# EasyEDA Pro project ProPrj_Open Quantum Front Cover_2025-07-02.epro

# Schematic Schematic1
Board Name: Board1; Create Date: 2025-06-29; Page Name: P1; Project Name: Open Quantum Front Cover; Schematic Name: Schematic1; Update Date: 2025-06-29; Company: EasyEDA.com; Page Size: A4; Version: V1.0
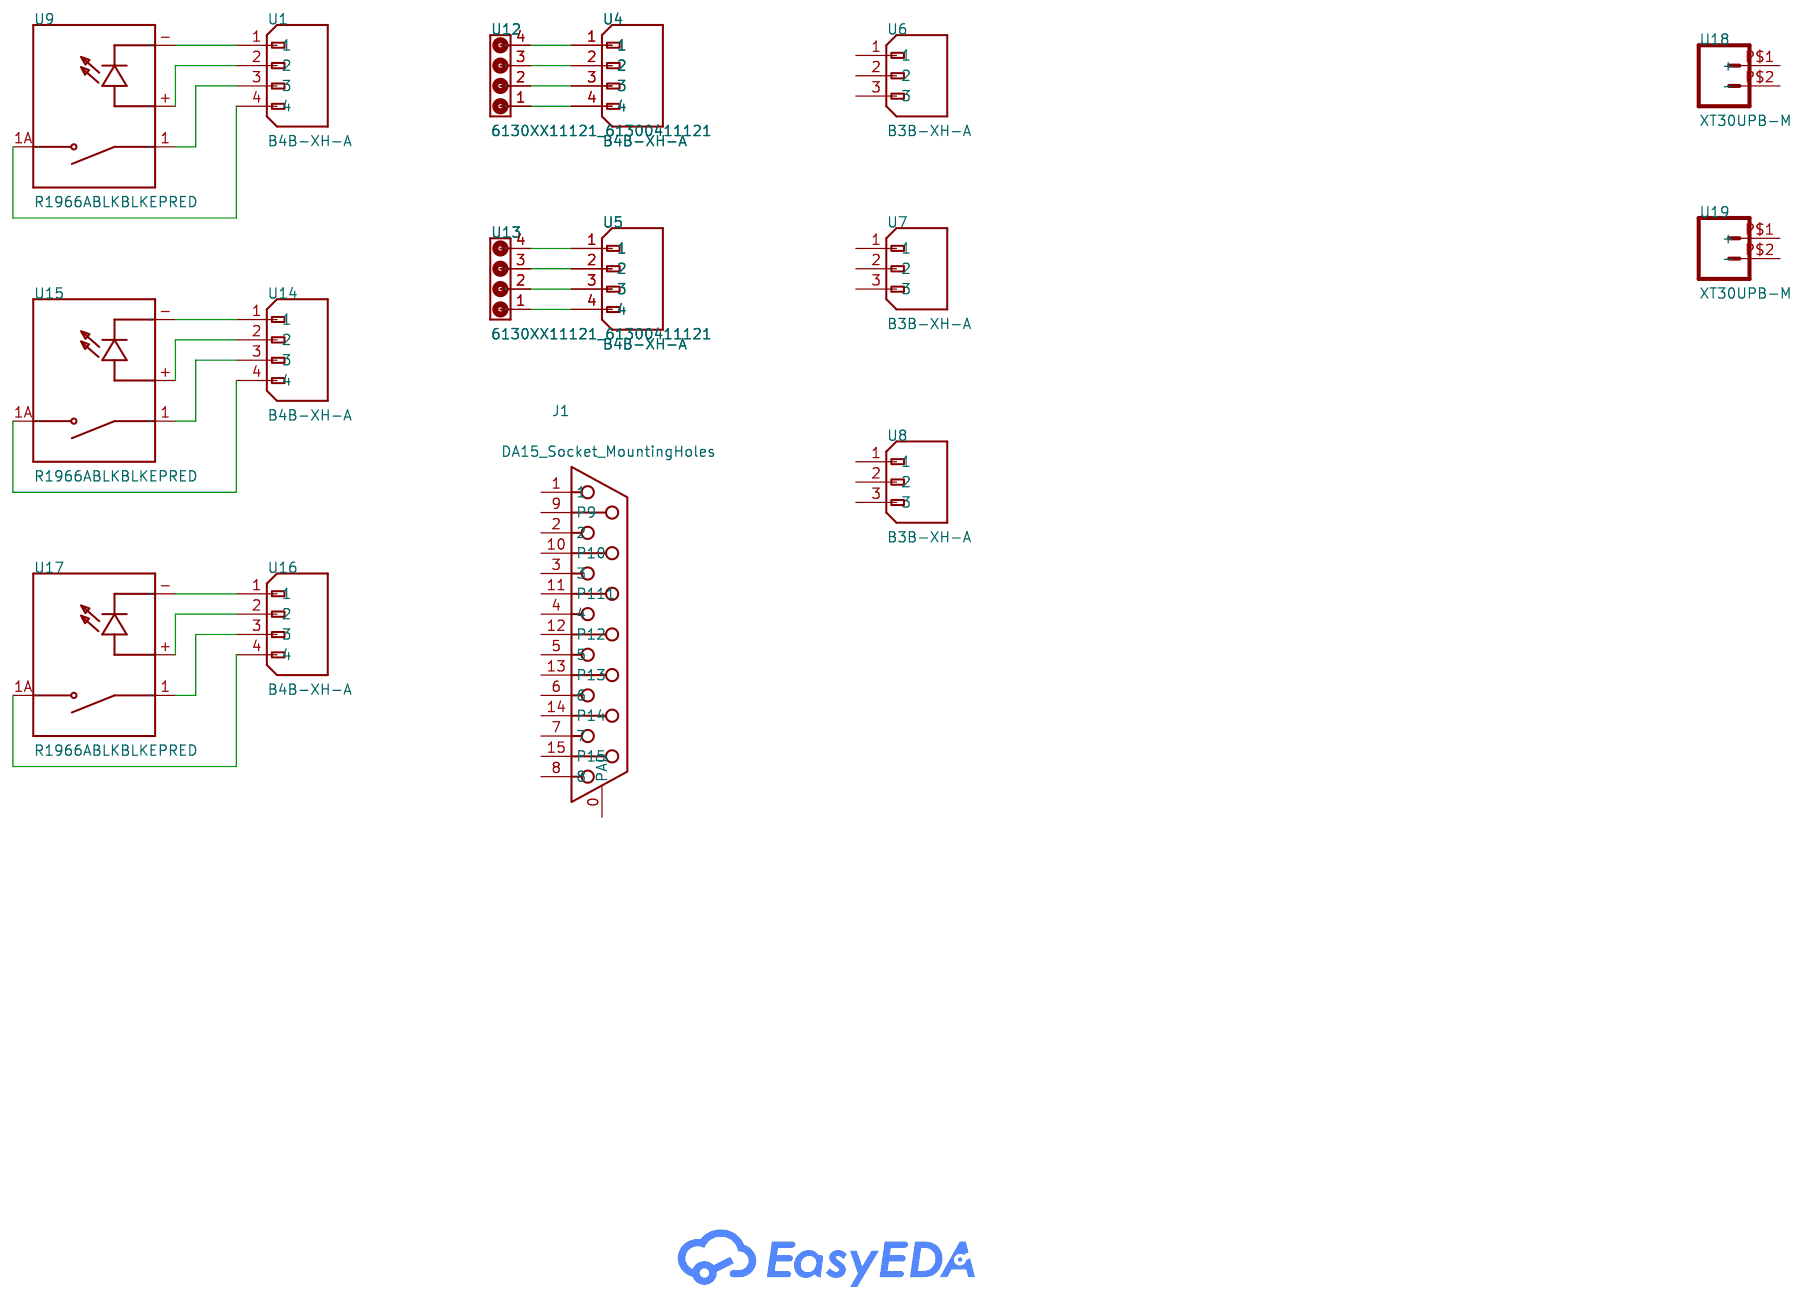
[diagram p0: schematic sheet]

## Parts
J1  DA15_Socket_MountingHoles  [Connector_Dsub:DSUB-15_Socket_Vertical_P2.77x2.84mm_MountingHoles]
U1  B4B-XH-A  [JST_B4B-XH-A]
U4  B4B-XH-A  [JST_B4B-XH-A]
U5  B4B-XH-A  [JST_B4B-XH-A]
U6  B3B-XH-A  [JST_B3B-XH-A]
U7  B3B-XH-A  [JST_B3B-XH-A]
U8  B3B-XH-A  [JST_B3B-XH-A]
U9  R1966ABLKBLKEPRED  [SW_R1966ABLKBLKEPRED]
U12  6130XX11121_61300411121  [61300411121]
U13  6130XX11121_61300411121  [61300411121]
U14  B4B-XH-A  [JST_B4B-XH-A]
U15  R1966ABLKBLKEPRED  [SW_R1966ABLKBLKEPRED]
U16  B4B-XH-A  [JST_B4B-XH-A]
U17  R1966ABLKBLKEPRED  [SW_R1966ABLKBLKEPRED]
U18  XT30UPB-M  [XT30UPB-M]
U19  XT30UPB-M  [XT30UPB-M]

## Library data of the parts
J1 = Connector_DA15_Socket_MountingHoles: 15-pin D-SUB connector, socket (female) (low-density/2 columns), Mounting Hole; Users: REF**
U1 U4 U5 U14 U16 = B4B-XH-A
U6-U8 = B3B-XH-A
U9 U15 U17 = R1966ABLKBLKEPRED
U12 U13 = 6130XX11121_61300411121
U18 U19 = XT30UPB-M

## Nets
$1N449: U4.1 U12.4
$1N451: U4.2 U12.3
$1N453: U4.3 U12.2
$1N455: U4.4 U12.1
$1N482: U5.1 U13.4
$1N484: U5.2 U13.3
$1N486: U5.3 U13.2
$1N488: U5.4 U13.1
$1N492: U1.1 U9.-(C)
$1N496: U1.2 U9.+(A)
$1N502: U1.3 U9.1
$1N514: U1.4 U9.1A
$1N571: U14.1 U15.-(C)
$1N573: U14.2 U15.+(A)
$1N576: U14.3 U15.1
$1N580: U14.4 U15.1A
$1N634: U16.1 U17.-(C)
$1N636: U16.2 U17.+(A)
$1N639: U16.3 U17.1
$1N643: U16.4 U17.1A

Not connected (* = marked no-connect by the designer): J1 0(PAD) 1 2 3 4 5 6 7 8 9(P9) 10(P10) 11(P111) 12(P12) 13(P13) 14(P14) 15(P15); U6 1 2 3; U7 1 2 3; U8 1 2 3; U18 P$1(+) P$2(-); U19 P$1(+) P$2(-)

# Board PCB1
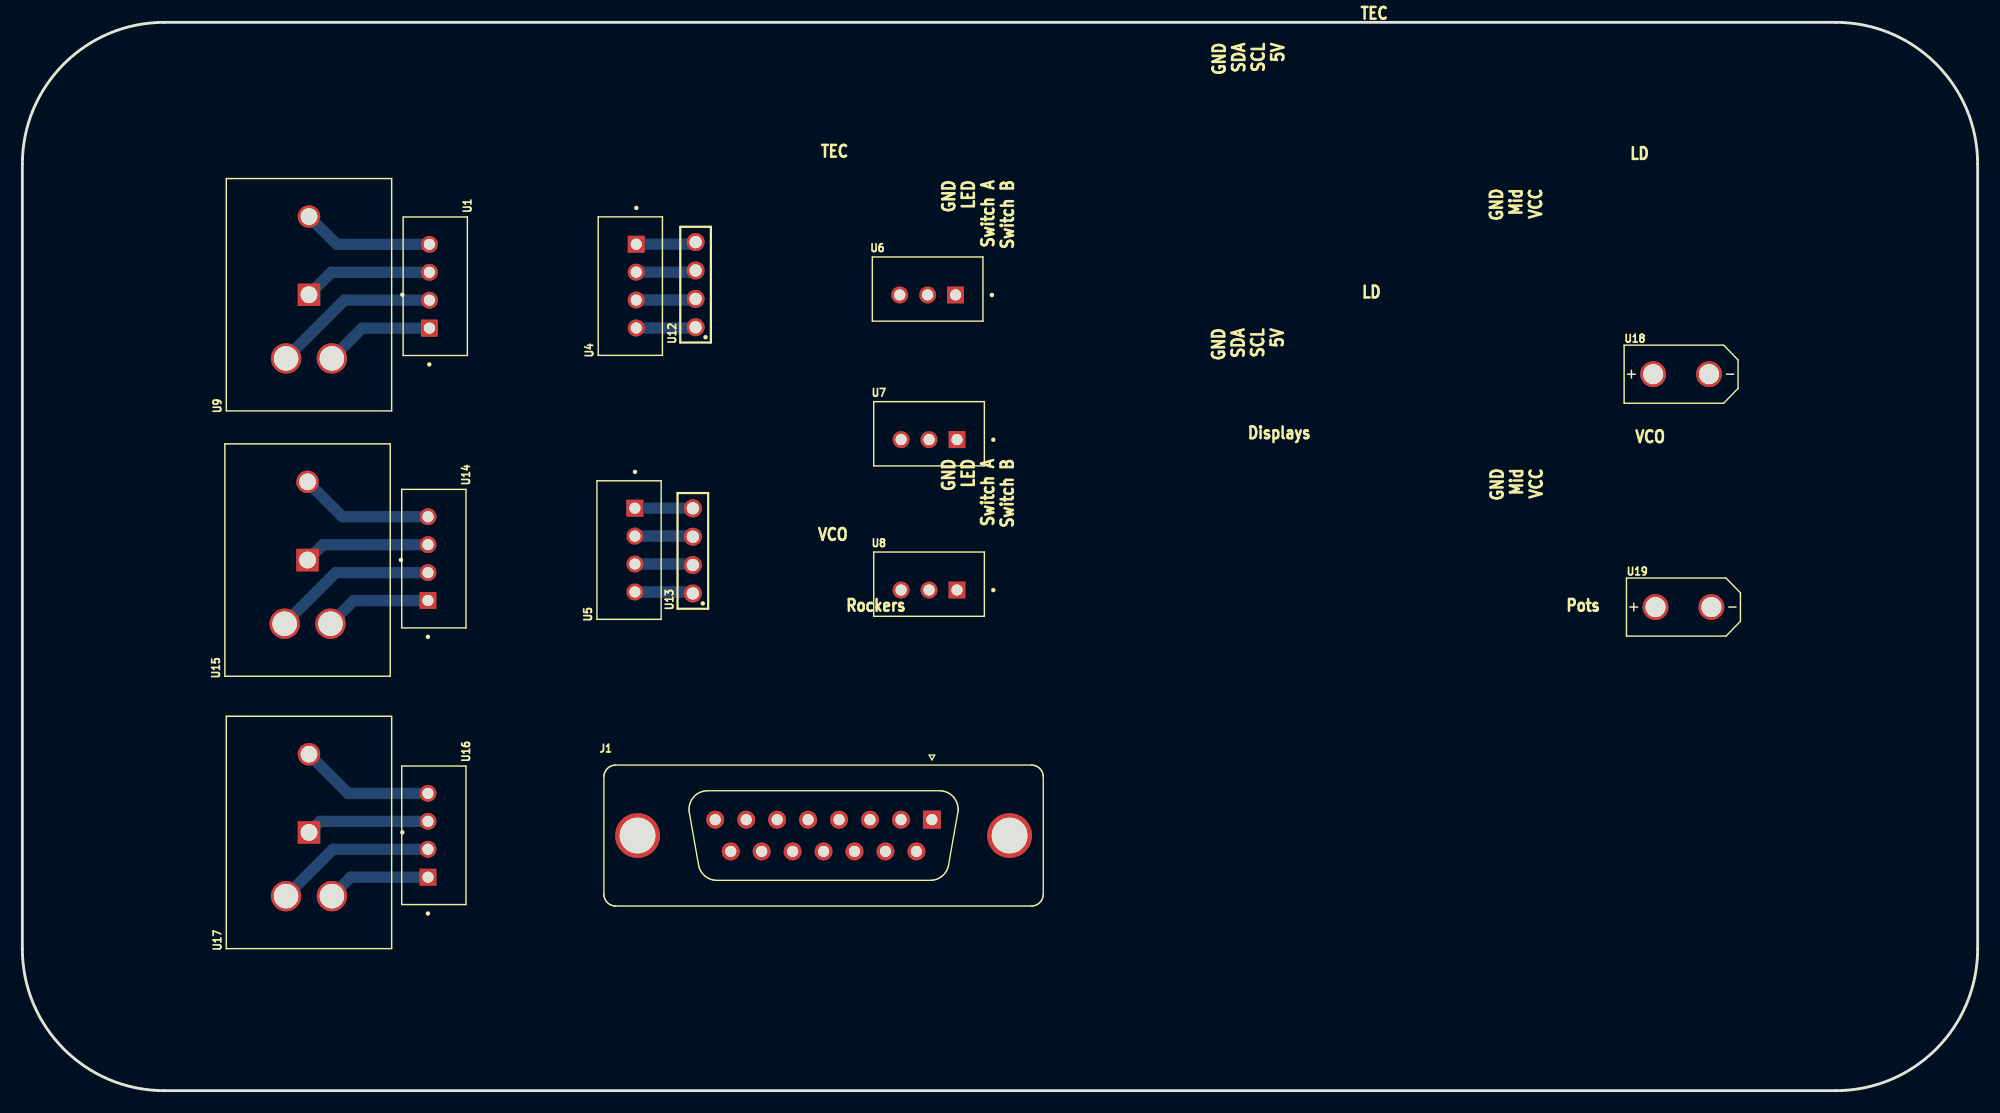
[diagram p1: board, top side]
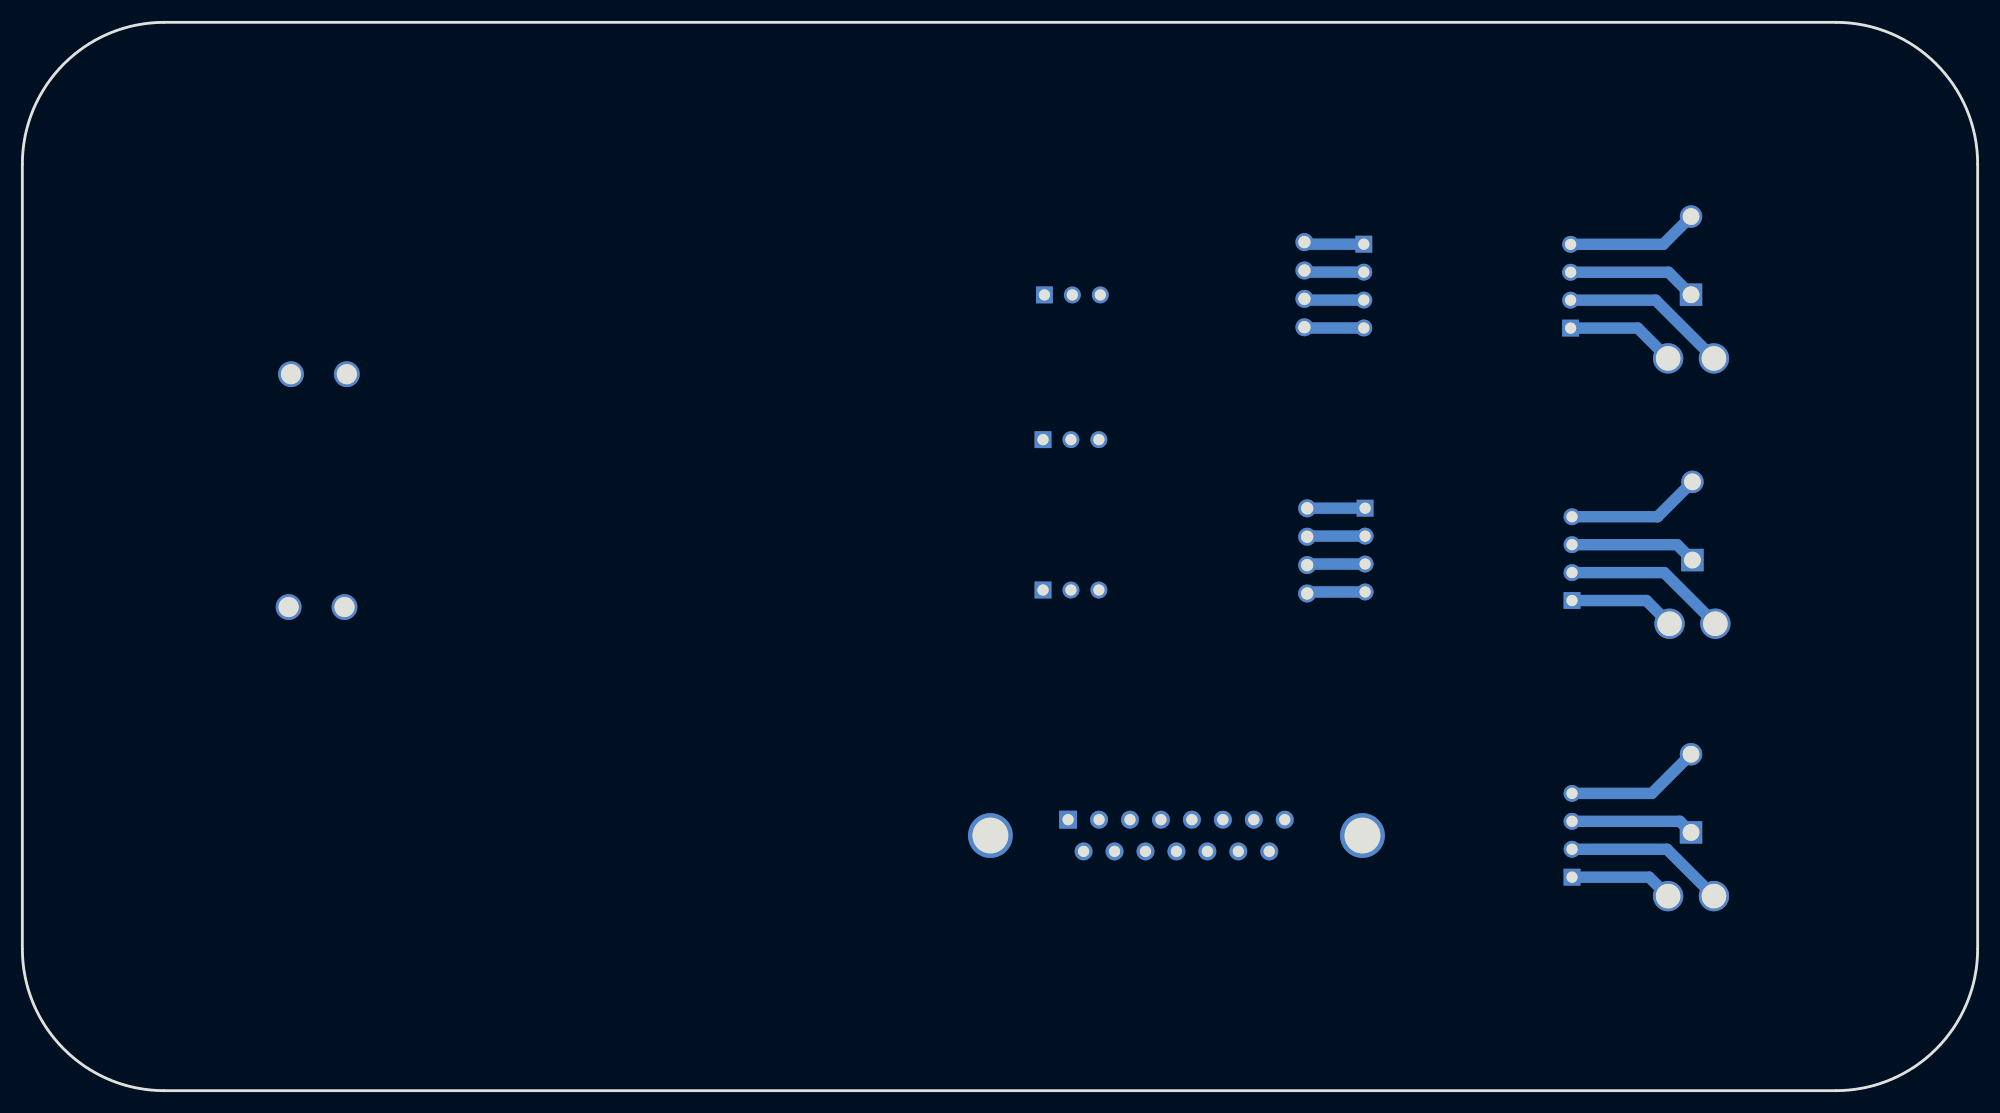
[diagram p2: board, bottom side, seen from below]

Outline 175.01 x 95.63 mm; copper layers: Top Layer, Bottom Layer. Coordinates in mm from the lower left corner of the outline.
Outline path: 0,82.93 0,12.7 arc(3.72,3.72) 12.7,0 162.31,0 arc(171.29,3.72) 175.01,12.7 175.01,82.93 arc(171.29,91.91) 162.31,95.63 12.7,95.63 arc(3.72,91.91) 0,82.93
Stack: Top Layer 0.035mm / Dielectric1 1.51mm FR4 er 4.5 / Bottom Layer 0.035mm

## Design rules (mm)
template: JLCPCB Capability(Two Layers Board)
spacing copperThickness1oz (default): track to track 0.102, other pairs 0.152 to 0.3
spacing copperThickness2oz: track to track 0.203, other pairs 0.152 to 0.3
track width copperThickness1oz (default): min 0.127, default 0.254, max 2.54
track width copperThickness2oz: min 0.203, default 0.254, max 2.54
differential pair differentialPair (default): width min 0.127, default 0.254, max 2.54; gap min 0.152, default 0.152
via viaSize (default): diameter min 0.5, default 0.61, max 10; hole min 0.3, default 0.305, max 6.3

## Placement (name value [footprint] x y rotation side)
J1  DA15_Socket_MountingHoles  [Connector_Dsub:DSUB-15_Socket_Vertical_P2.77x2.84mm_MountingHoles]  81.41 24.26 0 top
U1  B4B-XH-A  [JST_B4B-XH-A]  36.96 72.01 270 top
U4  B4B-XH-A  [JST_B4B-XH-A]  54.42 72.02 90 top
U5  B4B-XH-A  [JST_B4B-XH-A]  54.3 48.39 90 top
U6  B3B-XH-A  [JST_B3B-XH-A]  81.03 71.76 0 top
U7  B3B-XH-A  [JST_B3B-XH-A]  81.15 58.8 0 top
U8  B3B-XH-A  [JST_B3B-XH-A]  81.15 45.34 0 top
U9  R1966ABLKBLKEPRED  [SW_R1966ABLKBLKEPRED]  25.65 71.25 90 top
U12  6130XX11121_61300411121  [61300411121]  60.26 72.15 90 top
U13  6130XX11121_61300411121  [61300411121]  60.01 48.32 90 top
U14  B4B-XH-A  [JST_B4B-XH-A]  36.83 47.62 270 top
U15  R1966ABLKBLKEPRED  [SW_R1966ABLKBLKEPRED]  25.53 47.5 90 top
U16  B4B-XH-A  [JST_B4B-XH-A]  36.83 22.86 270 top
U17  R1966ABLKBLKEPRED  [SW_R1966ABLKBLKEPRED]  25.65 23.11 90 top
U18  -  [XT30UPB-M]  148.46 64.14 0 top
U19  -  [XT30UPB-M]  148.67 43.29 0 top

## Footprints (pads in the part's own frame, mm; a bottom-side part is the same pattern mirrored in y, then rotated)
61300411121
  round 1.608 hole 1.1: 1(-3.81,0) 2(-1.27,0) 3(1.27,0) 4(3.81,0)
Connector_Dsub:DSUB-15_Socket_Vertical_P2.77x2.84mm_MountingHoles
  round 4 hole 3.2: 0(-26.345,-1.42) 0(6.955,-1.42)
  rect 1.6x1.6 hole 1: 1(0,0)
  round 1.6 hole 1: 2(-2.77,0) 3(-5.54,0) 4(-8.31,0) 5(-11.08,0) 6(-13.85,0) 7(-16.62,0) 8(-19.39,0) 9(-1.385,-2.84) 10(-4.155,-2.84) 11(-6.925,-2.84) 12(-9.695,-2.84) 13(-12.465,-2.84) 14(-15.235,-2.84) 15(-18.005,-2.84)
JST_B3B-XH-A
  rect 1.508x1.508 hole 1: 1(2.5,-0.525)
  round 1.508 hole 1: 2(0,-0.525) 3(-2.5,-0.525)
JST_B4B-XH-A
  rect 1.508x1.508 hole 1: 1(3.75,-0.525)
  round 1.508 hole 1: 2(1.25,-0.525) 3(-1.25,-0.525) 4(-3.75,-0.525)
SW_R1966ABLKBLKEPRED
  round 2.708 hole 2.2: +(-5.7,2.05) -(-5.7,-2.05)
  rect 2.008x2.008 hole 1.5: 1(0,0)
  round 2.008 hole 1.5: 1A(7,0)
XT30UPB-M
  round 2.308 hole 1.8: P$1(-2.5,0) P$2(2.5,0)

## Nets
As in the schematic.

Pads without a net: J1 0 1 2 3 4 5 6 7 8 9 10 11 12 13 14 15; U6 1 2 3; U7 1 2 3; U8 1 2 3; U18 P$1 P$2; U19 P$1 P$2

## Routing (per net, layer and track width the routed paths; a pad name or vN(x,y) marks a point on that pad's centre or on a via; arc(x,y) is an arc through that point)
$1N449: length 5.4
  Bottom Layer w1.016: U12.4 60.07,75.77 U4.1
$1N451: length 5.4
  Bottom Layer w1.016: U12.3 60.11,73.27 U4.2
$1N453: length 5.4
  Bottom Layer w1.016: U12.2 60.15,70.77 U4.3
$1N455: length 5.3
  Bottom Layer w1.016: U4.4 60.19,68.27 U12.1
$1N482: length 5.2
  Bottom Layer w1.016: U5.1 60,52.14 U13.4
$1N484: length 5.2
  Bottom Layer w1.016: U13.3 59.96,49.64 U5.2
$1N486: length 5.2
  Bottom Layer w1.016: U5.3 59.92,47.14 U13.2
$1N488: length 5.2
  Bottom Layer w1.016: U5.4 59.88,44.64 U13.1
$1N492: length 9.9
  Bottom Layer w1.016: 27.7,65.55 30.42,68.26 U1.1
$1N496: length 15
  Bottom Layer w1.016: 23.6,65.55 28.82,70.76 U1.2
$1N502: length 11.6
  Bottom Layer w1.016: U9.1 27.67,73.26 U1.3
$1N514: length 11.8
  Bottom Layer w1.016: U1.4 28.14,75.76 U9.1A
$1N571: length 9.6
  Bottom Layer w1.016: U15.- 29.65,43.88 U14.1
$1N573: length 14.7
  Bottom Layer w1.016: U14.2 28.05,46.38 U15.+
$1N576: length 11.3
  Bottom Layer w1.016: U14.3 26.9,48.88 U15.1
$1N580: length 12.1
  Bottom Layer w1.016: U15.1A 28.65,51.38 U14.4
$1N634: length 9.3
  Bottom Layer w1.016: U17.- 29.4,19.11 U16.1
$1N636: length 14.4
  Bottom Layer w1.016: U16.2 27.8,21.61 U17.+
$1N639: length 11.1
  Bottom Layer w1.016: U16.3 26.65,24.11 U17.1
$1N643: length 12.1
  Bottom Layer w1.016: U16.4 29.16,26.61 U17.1A

## Text on the board
Top Silkscreen Layer: LD | VCO | TEC | Rockers | Displays | Pots | GND / LED / Switch A / Switch B | GND / SDA / SCL / 5V | GND / Mid / VCC
